# EAGLE design cubey_v2_8step (EAGLE 9.2.2)
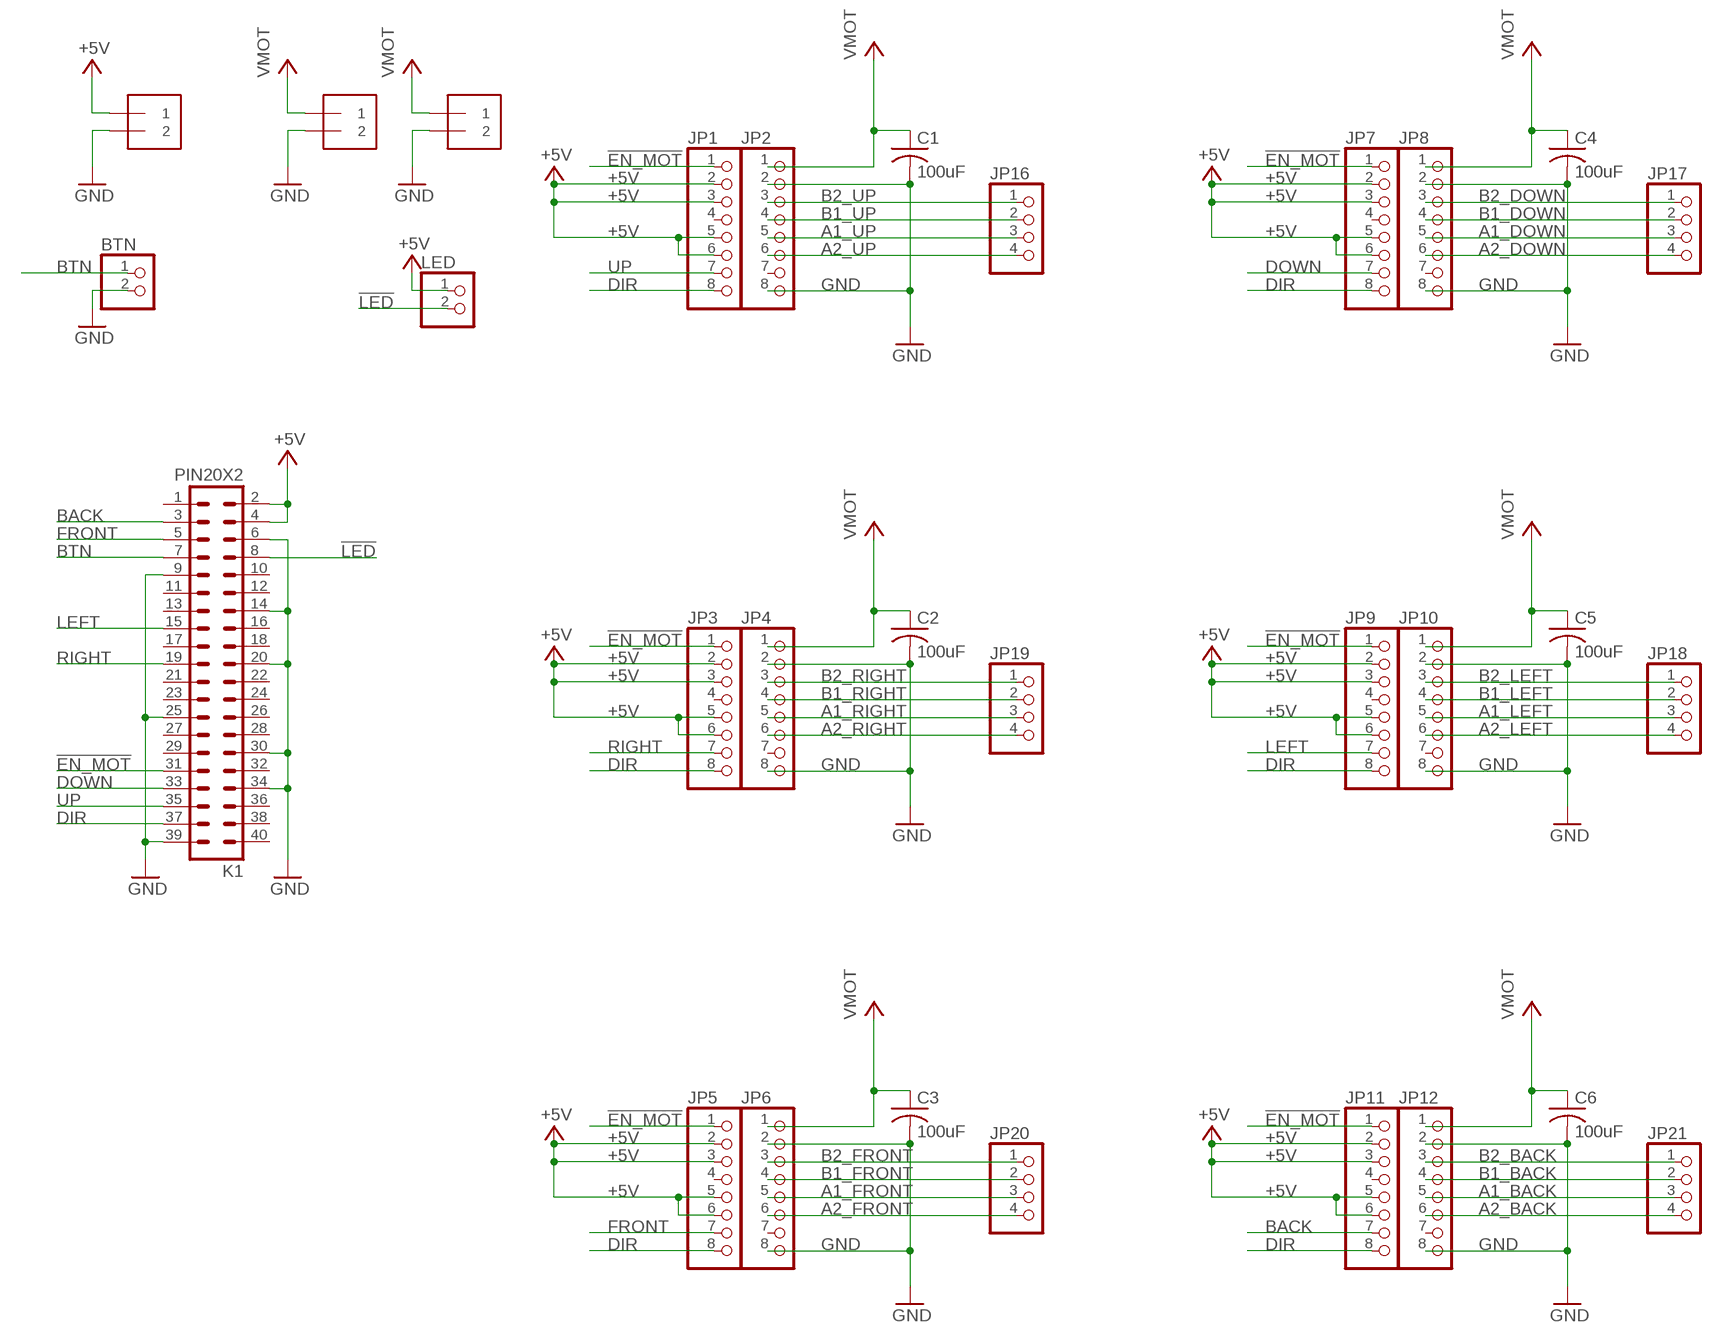
[diagram p0: schematic, sheet 1]

## Parts
5V_PWR  1X2-3.5MM  [1X2-3.5MM]
BTN  PINHD-1X2  [1X02]
C1  100uF  C-US025-025X050  [C025-025X050]
C2  100uF  C-US025-025X050  [C025-025X050]
C3  100uF  C-US025-025X050  [C025-025X050]
C4  100uF  C-US025-025X050  [C025-025X050]
C5  100uF  C-US025-025X050  [C025-025X050]
C6  100uF  C-US025-025X050  [C025-025X050]
JP1  PINHD-1X8  [1X08]
JP2  PINHD-1X8  [1X08]
JP3  PINHD-1X8  [1X08]
JP4  PINHD-1X8  [1X08]
JP5  PINHD-1X8  [1X08]
JP6  PINHD-1X8  [1X08]
JP7  PINHD-1X8  [1X08]
JP8  PINHD-1X8  [1X08]
JP9  PINHD-1X8  [1X08]
JP10  PINHD-1X8  [1X08]
JP11  PINHD-1X8  [1X08]
JP12  PINHD-1X8  [1X08]
JP16  PINHD-1X4  [1X04]
JP17  PINHD-1X4  [1X04]
JP18  PINHD-1X4  [1X04]
JP19  PINHD-1X4  [1X04]
JP20  PINHD-1X4  [1X04]
JP21  PINHD-1X4  [1X04]
K1  PIN20X2  [PIN_20X2]
LED  PINHD-1X2  [1X02]
MOT_PWR  1X2-3.5MM  [1X2-3.5MM]
MOT_PWR1  1X2-3.5MM  [1X2-3.5MM]

## Nets
!EN_MOT: JP1.1 JP3.1 JP5.1 JP7.1 JP9.1 JP11.1 K1.31
!LED: K1.8 LED.2
+5V: 5V_PWR.1 JP1.2 JP1.3 JP1.5 JP1.6 JP3.2 JP3.3 JP3.5 JP3.6 JP5.2 JP5.3 JP5.5 JP5.6 JP7.2 JP7.3 JP7.5 JP7.6 JP9.2 JP9.3 JP9.5 JP9.6 JP11.2 JP11.3 JP11.5 JP11.6 K1.2 K1.4 LED.1
A1_BACK: JP12.5 JP21.3
A1_DOWN: JP8.5 JP17.3
A1_FRONT: JP6.5 JP20.3
A1_LEFT: JP10.5 JP18.3
A1_RIGHT: JP4.5 JP19.3
A1_UP: JP2.5 JP16.3
A2_BACK: JP12.6 JP21.4
A2_DOWN: JP8.6 JP17.4
A2_FRONT: JP6.6 JP20.4
A2_LEFT: JP10.6 JP18.4
A2_RIGHT: JP4.6 JP19.4
A2_UP: JP2.6 JP16.4
B1_BACK: JP12.4 JP21.2
B1_DOWN: JP8.4 JP17.2
B1_FRONT: JP6.4 JP20.2
B1_LEFT: JP10.4 JP18.2
B1_RIGHT: JP4.4 JP19.2
B1_UP: JP2.4 JP16.2
B2_BACK: JP12.3 JP21.1
B2_DOWN: JP8.3 JP17.1
B2_FRONT: JP6.3 JP20.1
B2_LEFT: JP10.3 JP18.1
B2_RIGHT: JP4.3 JP19.1
B2_UP: JP2.3 JP16.1
BACK: JP11.7 K1.3
BTN: BTN.1 K1.7
DIR: JP1.8 JP3.8 JP5.8 JP7.8 JP9.8 JP11.8 K1.37
DOWN: JP7.7 K1.33
FRONT: JP5.7 K1.5
GND: 5V_PWR.2 BTN.2 C1.2 C2.2 C3.2 C4.2 C5.2 C6.2 JP2.2 JP2.8 JP4.2 JP4.8 JP6.2 JP6.8 JP8.2 JP8.8 JP10.2 JP10.8 JP12.2 JP12.8 K1.6 K1.9 K1.14 K1.20 K1.25 K1.30 K1.34 K1.39 MOT_PWR1.2 MOT_PWR.2
LEFT: JP9.7 K1.15
RIGHT: JP3.7 K1.19
UP: JP1.7 K1.35
VCC: C1.1 C2.1 C3.1 C4.1 C5.1 C6.1 JP2.1 JP4.1 JP6.1 JP8.1 JP10.1 JP12.1 MOT_PWR1.1 MOT_PWR.1 ; supply symbol labelled VMOT
Unconnected: JP1.4 JP2.7 JP3.4 JP4.7 JP5.4 JP6.7 JP7.4 JP8.7 JP9.4 JP10.7 JP11.4 JP12.7 K1.1 K1.10 K1.11 K1.12 K1.13 K1.16 K1.17 K1.18 K1.21 K1.22 K1.23 K1.24 K1.26 K1.27 K1.28 K1.29 K1.32 K1.36 K1.38 K1.40

## Library data of the parts
5V_PWR MOT_PWR MOT_PWR1 = adafruit:1X2: 3.5mm Terminal block http://www.ladyada.net/library/pcb/eaglelibrary.html
BTN LED = pinhead:PINHD-1X2: PIN HEADER
C1-C6 = rcl:C-US: CAPACITOR, American symbol; SPICEPREFIX: C
JP1-JP12 = pinhead:PINHD-1X8: PIN HEADER
JP16-JP21 = pinhead:PINHD-1X4: PIN HEADER
K1 = FLYFISH:PIN20X2

## Net classes
0 default: width 0.406 mm, clearance 0.203 mm

## Board
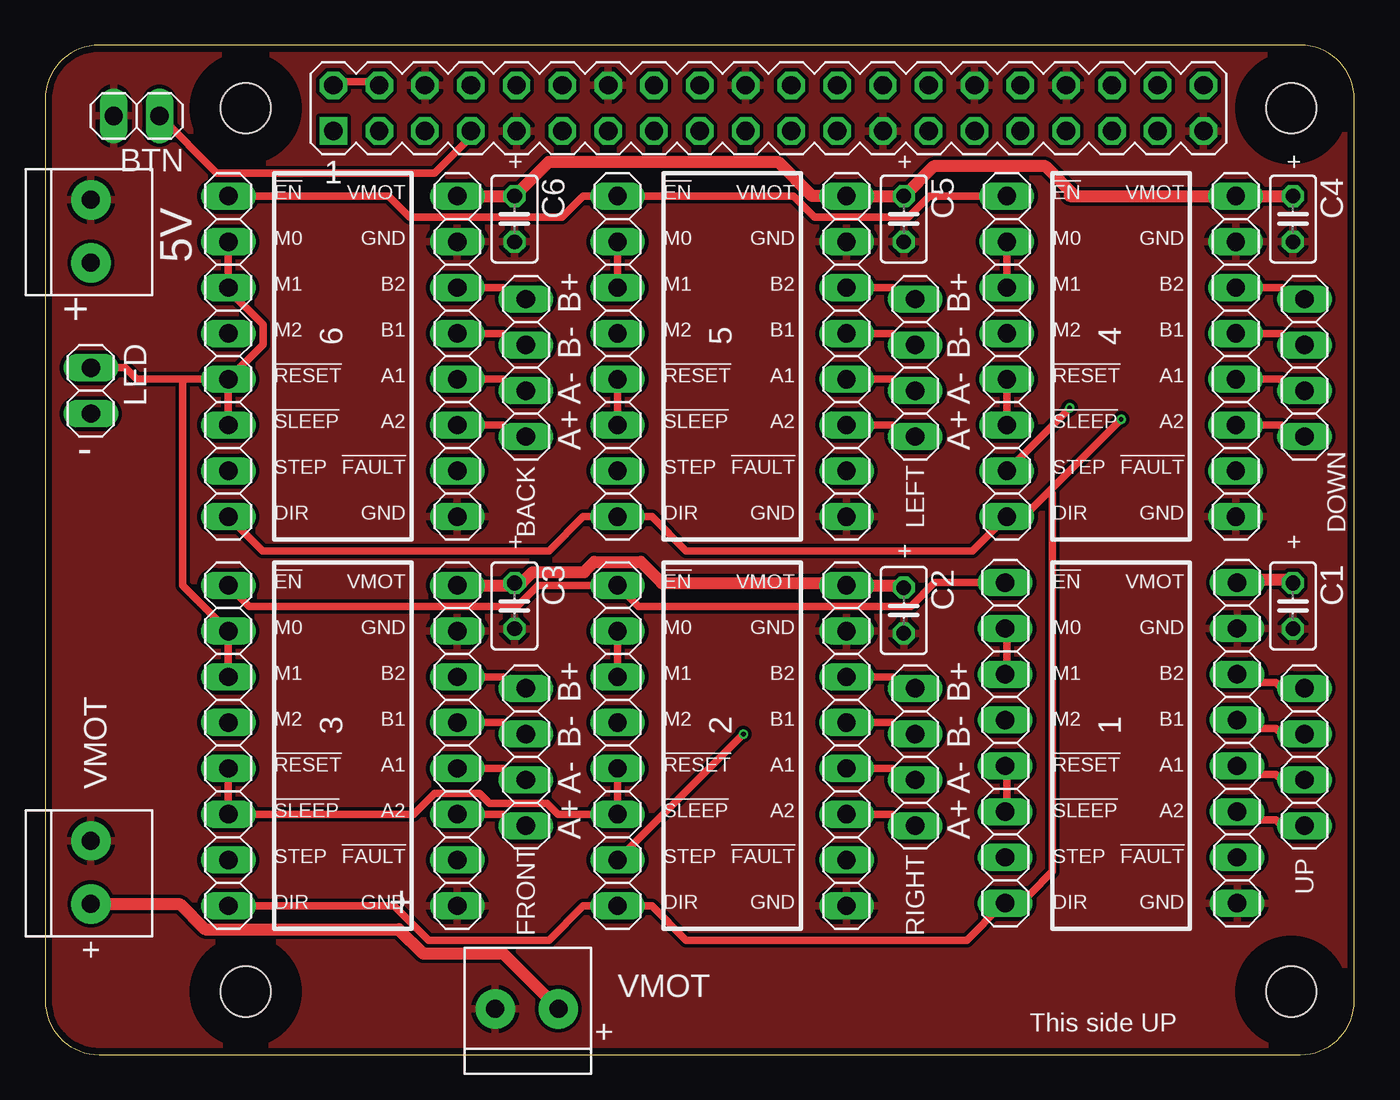
[diagram p1: board, top side]
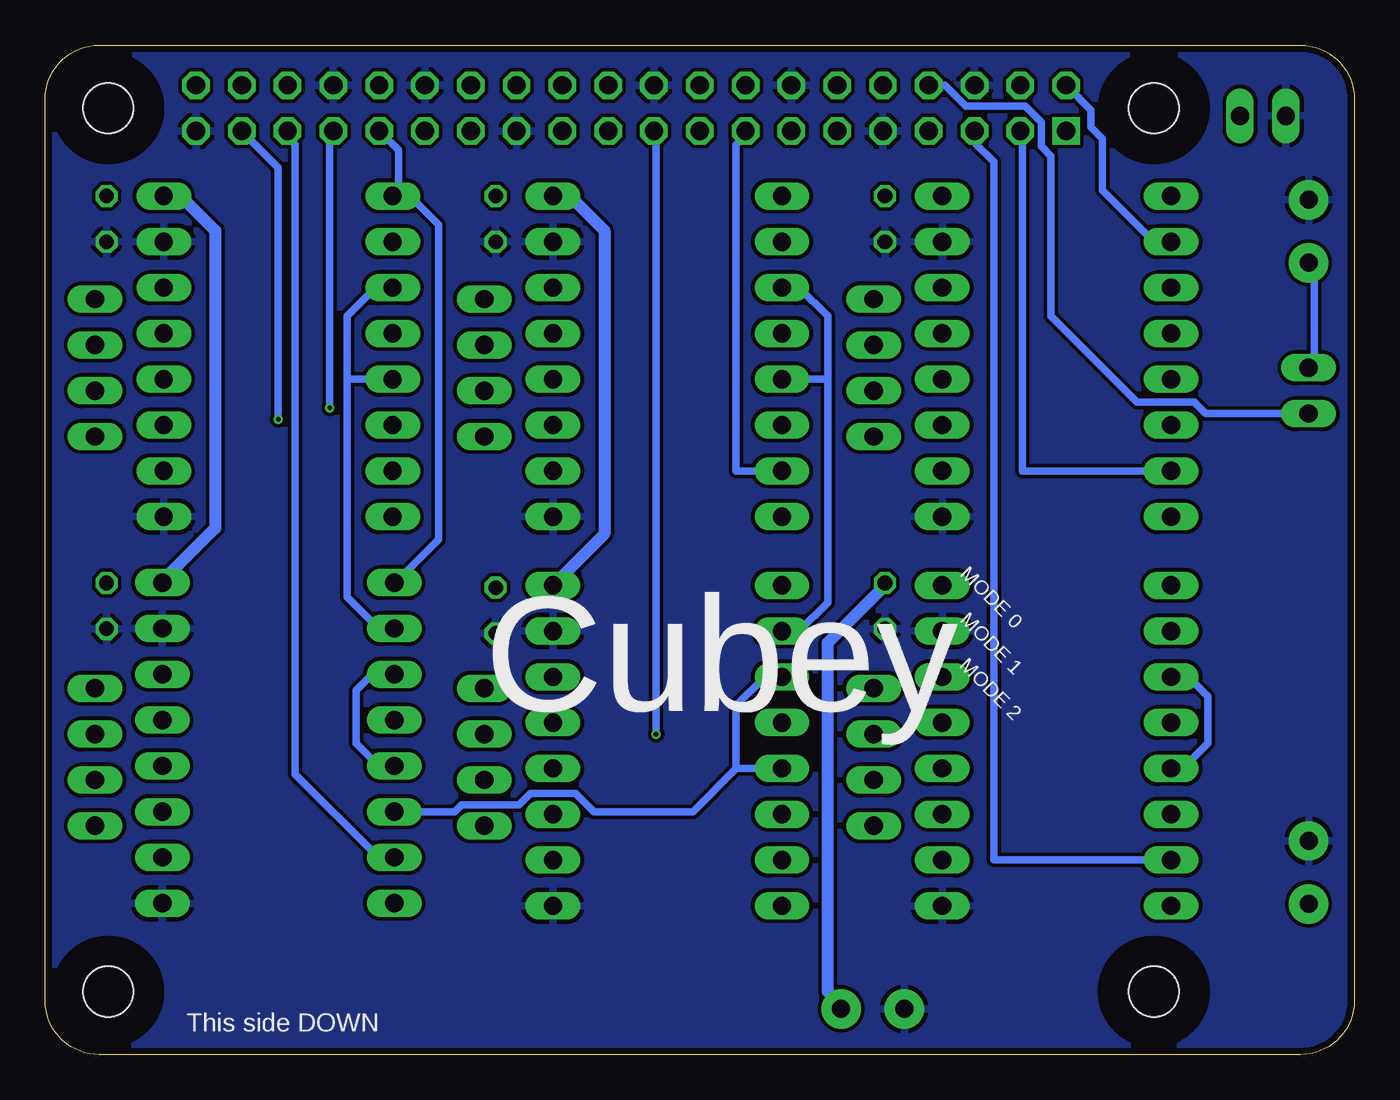
[diagram p2: board, bottom side, seen from below]

Size 72.62 x 56 mm. Coordinates in mm from the lower left corner, seen from the top.
Outline: 0,3 arc90 3,0 69.62,0 arc90 72.62,3 72.62,53 arc90 69.62,56 3,56 arc90 0,53 0,3
Copper layers (1*16): Top 0.035559375mm / dielectric 1.6mm / Bottom 0.035559375mm
Design rules "oshpark-2layer": minimum track width 6mil, minimum drill 10mil, track to track 6mil, track to pad 6mil, pad to pad 6mil, via to via 6mil, smd to smd 6mil, copper to edge 15mil, drill to drill 6mil, minimum pad ring 5mil, minimum via ring 5mil, stop-mask expansion 2.5mil, vias tented up to drill 0mil, thermal gap 10mil
Holes 2.8 mm at 11.12,3.5 11.12,52.5 69.12,52.5 69.12,3.5
tRestrict: area 9.6,51 to 12.7,54; area 67.6,51 to 70.7,54; area 67.6,1.9 to 70.7,5; area 9.6,1.9 to 12.7,5
bRestrict: area 9.6,1.9 to 12.7,5; area 9.6,51 to 12.7,54; area 67.6,1.9 to 70.7,5; area 67.6,51 to 70.7,54

### Footprints (pad centres in the part's own frame; a part is rotated, then mirrored left to right if it is on the bottom)
1X2-3.5MM = drill 1 pad 2.184: 1 1.8,0; 2 -1.7,0
1X02 = drill 1.016 long: 1 -1.27,0; 2 1.27,0
C025-025X050 = drill 0.813 octagon: 1 -1.27,0; 2 1.27,0
1X08 = drill 1.016 long: 1 -8.89,0; 2 -6.35,0; 3 -3.81,0; 4 -1.27,0; 5 1.27,0; 6 3.81,0; 7 6.35,0; 8 8.89,0
1X04 = drill 1.016 long: 1 -3.81,0; 2 -1.27,0; 3 1.27,0; 4 3.81,0
PIN_20X2 = drill 1.016 square: 1 -24.13,-1.27 | drill 1.016 octagon: 2 -24.13,1.27; 3 -21.59,-1.27; 4 -21.59,1.27; 5 -19.05,-1.27; 6 -19.05,1.27; 7 -16.51,-1.27; 8 -16.51,1.27; 9 -13.97,-1.27; 10 -13.97,1.27; 11 -11.43,-1.27; 12 -11.43,1.27; 13 -8.89,-1.27; 14 -8.89,1.27; 15 -6.35,-1.27; 16 -6.35,1.27; 17 -3.81,-1.27; 18 -3.81,1.27; 19 -1.27,-1.27; 20 -1.27,1.27; 21 1.27,-1.27; 22 1.27,1.27; 23 3.81,-1.27; 24 3.81,1.27; 25 6.35,-1.27; 26 6.35,1.27; 27 8.89,-1.27; 28 8.89,1.27; 29 11.43,-1.27; 30 11.43,1.27; 31 13.97,-1.27; 32 13.97,1.27; 33 16.51,-1.27; 34 16.51,1.27; 35 19.05,-1.27; 36 19.05,1.27; 37 21.59,-1.27; 38 21.59,1.27; 39 24.13,-1.27; 40 24.13,1.27

### Placement (x,y rotation side)
5V_PWR  2.54,45.72 270 top
BTN  5.08,52.07 180 top
C1  69.22,24.89 270 top
C2  47.62,24.64 270 top
C3  26.04,24.89 270 top
C4  69.22,46.35 270 top
C5  47.62,46.35 270 top
C6  26.04,46.35 270 top
JP1  53.26,17.29 270 top
JP2  66.11,17.29 270 top
JP3  31.75,17.14 270 top
JP4  44.45,17.14 270 top
JP5  10.16,17.14 270 top
JP6  22.86,17.14 270 top
JP7  53.34,38.73 270 top
JP8  66.04,38.73 270 top
JP9  31.75,38.73 270 top
JP10  44.45,38.73 270 top
JP11  10.16,38.73 270 top
JP12  22.86,38.73 270 top
JP16  69.85,16.51 270 top
JP17  69.85,38.1 270 top
JP18  48.26,38.1 270 top
JP19  48.26,16.51 270 top
JP20  26.67,16.51 270 top
JP21  26.67,38.1 270 top
K1  40.12,52.5 0 top
LED  2.54,36.83 270 top
MOT_PWR  26.67,2.54 0 top
MOT_PWR1  2.54,10.16 270 top

### Tracks (layer width: path | path; a pad name or v marks a point on that pad's centre or on a via)
!EN_MOT
  Top 0.406: JP11.1 19.05,47.62 20.22,46.46 28.68,46.46 29.84,47.62 JP9.1 41.5,47.62 42.67,46.46 47.89,46.46 49.06,47.62 JP7.1 | 53.02,26.35 JP1.1 49.33,26.18 48.02,24.87 32.92,24.87 JP3.1 27.34,26.04 26.18,24.87 11.33,24.87 JP5.1
  Bottom 0.406: 53.02,47.62 52.39,47.62 50.8,46.04 50.8,28.57 53.02,26.35 JP1.1 | 53.02,47.62 53.02,50.16 53.98,51.12 K1.31 | 53.02,47.62 JP7.1
!LED
  Bottom 0.406: LED.2 8.26,35.56 8.89,36.2 12.06,36.2 16.83,40.96 16.83,49.85 17.36,50.38 17.36,51.71 18.25,52.6 21.55,52.6 22.72,53.77 K1.8
+5V
  Top 0.406: JP5.5 JP5.6 20.45,13.34 21.61,14.5 24.11,14.5 24.66,13.95 27.84,13.95 28.45,13.34 JP3.6 JP3.5 | JP5.3 JP5.2 7.62,26.04 7.62,37.47 | K1.2 16.19,53.98 18.41,53.98 K1.4 | JP11.2 JP11.3 10.16,42.42 12.09,40.49 12.09,39.4 JP11.5 | JP11.5 JP11.6 | 7.62,37.47 5.08,37.47 4.45,38.1 LED.1 | 7.62,37.47 JP11.5 | JP7.5 JP7.6 | JP7.2 JP7.3 | JP1.6 53.34,13.65 53.34,15.88 JP1.5 | JP1.3 53.34,21.27 53.34,23.5 JP1.2 | JP9.5 JP9.6 | JP9.2 JP9.3 | JP3.2 JP3.3
  Bottom 0.406: JP5.5 9.53,15.88 8.13,17.27 8.13,19.88 9.21,20.95 JP5.3 | LED.1 2.22,38.42 2.22,43.5 2.54,43.81 5V_PWR.1 | JP11.2 11.11,45.09 13.97,47.94 13.97,50.8 14.61,51.44 14.61,52.39 15.88,53.66 K1.2 | 55.88,37.47 JP7.5 | 55.88,37.47 55.88,40.96 54.29,42.55 JP7.3 | JP1.5 53.34,16.19 54.29,16.19 55.37,17.27 55.37,20.19 54.61,20.95 53.34,20.95 JP1.3 | 55.88,37.47 55.88,25.4 54.29,23.81 53.34,23.81 JP1.2 | 29.21,37.47 JP9.5 | 29.21,37.47 29.21,40.96 30.8,42.55 JP9.3 | 34.29,15.88 JP3.5 | 34.29,15.88 34.29,19.37 32.7,20.95 JP3.3 | 29.21,37.47 29.21,25.08 30.8,23.5 JP3.2 | 52.39,13.34 53.02,13.34 JP1.6 49.89,13.48 49.51,13.87 46.33,13.87 45.7,14.5 43.2,14.5 42.18,13.48 36.69,13.48 34.29,15.88
A1_BACK
  Top 0.406: JP12.5 25.4,37.47 26.04,36.83 JP21.3
A1_DOWN
  Top 0.406: JP8.5 68.58,37.47 69.22,36.83 JP17.3
A1_FRONT
  Top 0.406: JP6.5 25.4,15.88 26.04,15.24 JP20.3
A1_LEFT
  Top 0.406: JP10.5 46.99,37.47 47.62,36.83 JP18.3
A1_RIGHT
  Top 0.406: JP4.5 46.99,15.88 47.62,15.24 JP19.3
A1_UP
  Top 0.406: JP16.3 68.58,15.24 68.26,15.56 66.67,15.56 66.36,15.88 JP2.5
A2_BACK
  Top 0.406: JP12.6 25.4,34.92 26.04,34.29 JP21.4
A2_DOWN
  Top 0.406: JP8.6 68.58,34.92 69.22,34.29 JP17.4
A2_FRONT
  Top 0.406: JP6.6 25.4,13.34 26.04,12.7 JP20.4
A2_LEFT
  Top 0.406: JP10.6 46.99,34.92 47.62,34.29 JP18.4
A2_RIGHT
  Top 0.406: JP4.6 46.99,13.34 47.62,12.7 JP19.4
A2_UP
  Top 0.406: JP16.4 68.58,12.7 68.26,13.02 66.67,13.02 66.36,13.34 JP2.6
B1_BACK
  Top 0.406: JP12.4 25.4,40.01 26.04,39.37 JP21.2
B1_DOWN
  Top 0.406: JP8.4 68.58,40.01 69.22,39.37 JP17.2
B1_FRONT
  Top 0.406: JP6.4 25.4,18.41 26.04,17.78 JP20.2
B1_LEFT
  Top 0.406: JP10.4 46.99,40.01 47.62,39.37 JP18.2
B1_RIGHT
  Top 0.406: JP4.4 46.99,18.41 47.62,17.78 JP19.2
B1_UP
  Top 0.406: JP16.2 68.58,17.78 68.26,18.1 66.67,18.1 66.36,18.41 JP2.4
B2_BACK
  Top 0.406: JP12.3 25.4,42.55 26.04,41.91 JP21.1
B2_DOWN
  Top 0.406: JP8.3 68.58,42.55 69.22,41.91 JP17.1
B2_FRONT
  Top 0.406: JP6.3 25.4,20.95 26.04,20.32 JP20.1
B2_LEFT
  Top 0.406: JP10.3 46.99,42.55 47.62,41.91 JP18.1
B2_RIGHT
  Top 0.406: JP4.3 46.99,20.95 47.62,20.32 JP19.1
B2_UP
  Top 0.406: JP16.1 68.58,20.32 68.26,20.64 66.67,20.64 66.36,20.95 JP2.3
BACK
  Bottom 0.406: JP11.7 18.41,32.38 18.41,51.12 K1.3
BTN
  Top 0.406: BTN.1 9.53,48.9 21.59,48.9 23.81,51.12 K1.7
DIR  (via drill 0.25)
  Top 0.406: JP5.8 19.37,8.26 21.27,6.35 27.94,6.35 29.84,8.26 JP3.8 33.66,8.26 35.56,6.35 51.12,6.35 53.02,8.26 JP1.8 53.34,8.57 53.66,8.89 54.61,8.89 55.88,10.16 55.88,31.11 55.56,31.11 | JP11.8 12.06,27.94 27.94,27.94 29.84,29.84 JP9.8 33.66,29.84 35.56,27.94 51.44,27.94 JP7.8 54.29,29.84 55.56,31.11 | 55.56,31.11 v59.69,35.24
  Bottom 0.406: v59.69,35.24 59.69,49.21 61.59,51.12 K1.37
DOWN  (via drill 0.25)
  Top 0.406: v56.83,35.88 JP7.7
  Bottom 0.406: v56.83,35.88 56.83,51.12 K1.33
FRONT
  Bottom 0.406: JP5.7 20,10.79 20,49.53 20.95,50.48 20.95,51.12 K1.5
GND
  pour Top: -3.81,58.42 78.74,58.42 78.74,-1.27 -3.81,-1.27
  pour Bottom: -1.27,60.96 76.2,60.96 76.2,-2.54 -1.27,-2.54
LEFT
  Bottom 0.406: JP9.7 34.29,32.38 34.29,50.48 33.97,50.8 33.97,51.03 K1.15
RIGHT  (via drill 0.25)
  Top 0.406: v38.73,17.78 JP3.7
  Bottom 0.406: v38.73,17.78 38.73,51.12 K1.19
UP
  Bottom 0.406: JP1.7 53.34,11.11 54.29,11.11 58.74,15.56 58.74,50.48 59.05,50.8 59.05,51.12 K1.35
VCC
  Top 0.406: 2.54,8.57 MOT_PWR1.1 | 66.36,26.35 JP2.1 | C5.1 47.94,47.62 | 26.04,26.04 C3.1
  Top 0.66: JP6.1 26.04,26.04 | 66.36,26.35 69.22,26.35 C1.1 | C4.1 JP8.1 57.15,47.62 | JP12.1 C6.1 27.94,49.53 40.64,49.53 42.55,47.62 JP10.1 C5.1 49.28,49.28 55.5,49.28 57.15,47.62 | C2.1 47.62,26.04 JP4.1 44.32,26.16 34.22,26.16 33.05,27.33 30.45,27.33 29.89,26.77 27.04,26.77 26.43,26.16 C3.1 | 56.83,47.62 57.15,47.62 | MOT_PWR.1 25.4,5.61 20.97,5.61 19.62,6.96 8.86,6.96 7.46,8.36 MOT_PWR1.1
  Bottom 0.406: 26.04,26.04 C3.1 | 28.57,2.54 MOT_PWR.1 | JP8.1 65.09,47.62 | JP10.1 43.5,47.62
  Bottom 0.66: 26.04,26.04 29.21,22.86 29.21,3.49 28.57,2.86 28.57,2.54 | 65.09,47.62 63.18,45.72 63.18,29.21 66.04,26.35 JP2.1 | JP4.1 41.59,28.89 41.59,45.72 43.5,47.62

### Text on the board
tNames: + | + | + | !EN | VMOT | !EN | VMOT | !EN | VMOT | 5V | M0 | GND | M0 | GND | M0 | GND | M1 | B2 | M1 | B2 | M1 | B2 | + | M2 | B1 | B+ | M2 | B1 | B+ | M2 | B1 | 6 | B- | 5 | B- | 4 | !RESET | A1 | !RESET | A1 | !RESET | A1 | !SLEEP | A2 | A- | !SLEEP | A2 | A- | !SLEEP | A2 | A+ | A+ | - | STEP | !FAULT | STEP | !FAULT | STEP | !FAULT | DIR | GND | DIR | GND | DIR | GND | BACK | LEFT | DOWN | + | + | !EN | VMOT | !EN | VMOT | + | !EN | VMOT | M0 | GND | M0 | GND | M0 | GND | M1 | B2 | M1 | B2 | M1 | B2 | B+ | B+ | M2 | B1 | M2 | B1 | M2 | B1 | 3 | 2 | 1 | !RESET | A1 | B- | !RESET | A1 | B- | !RESET | A1 | VMOT | !SLEEP | A2 | A- | !SLEEP | A2 | A- | !SLEEP | A2 | A+ | A+ | STEP | !FAULT | STEP | !FAULT | STEP | !FAULT | DIR | GND | DIR | GND | DIR | GND | UP | + | FRONT | RIGHT | + | VMOT | + | This side UP
bNames: MODE 0 | MODE 1 | MODE 2 | Cubey | This side DOWN